# EAGLE design pot_controller_v1.0 (EAGLE 9.6.2)
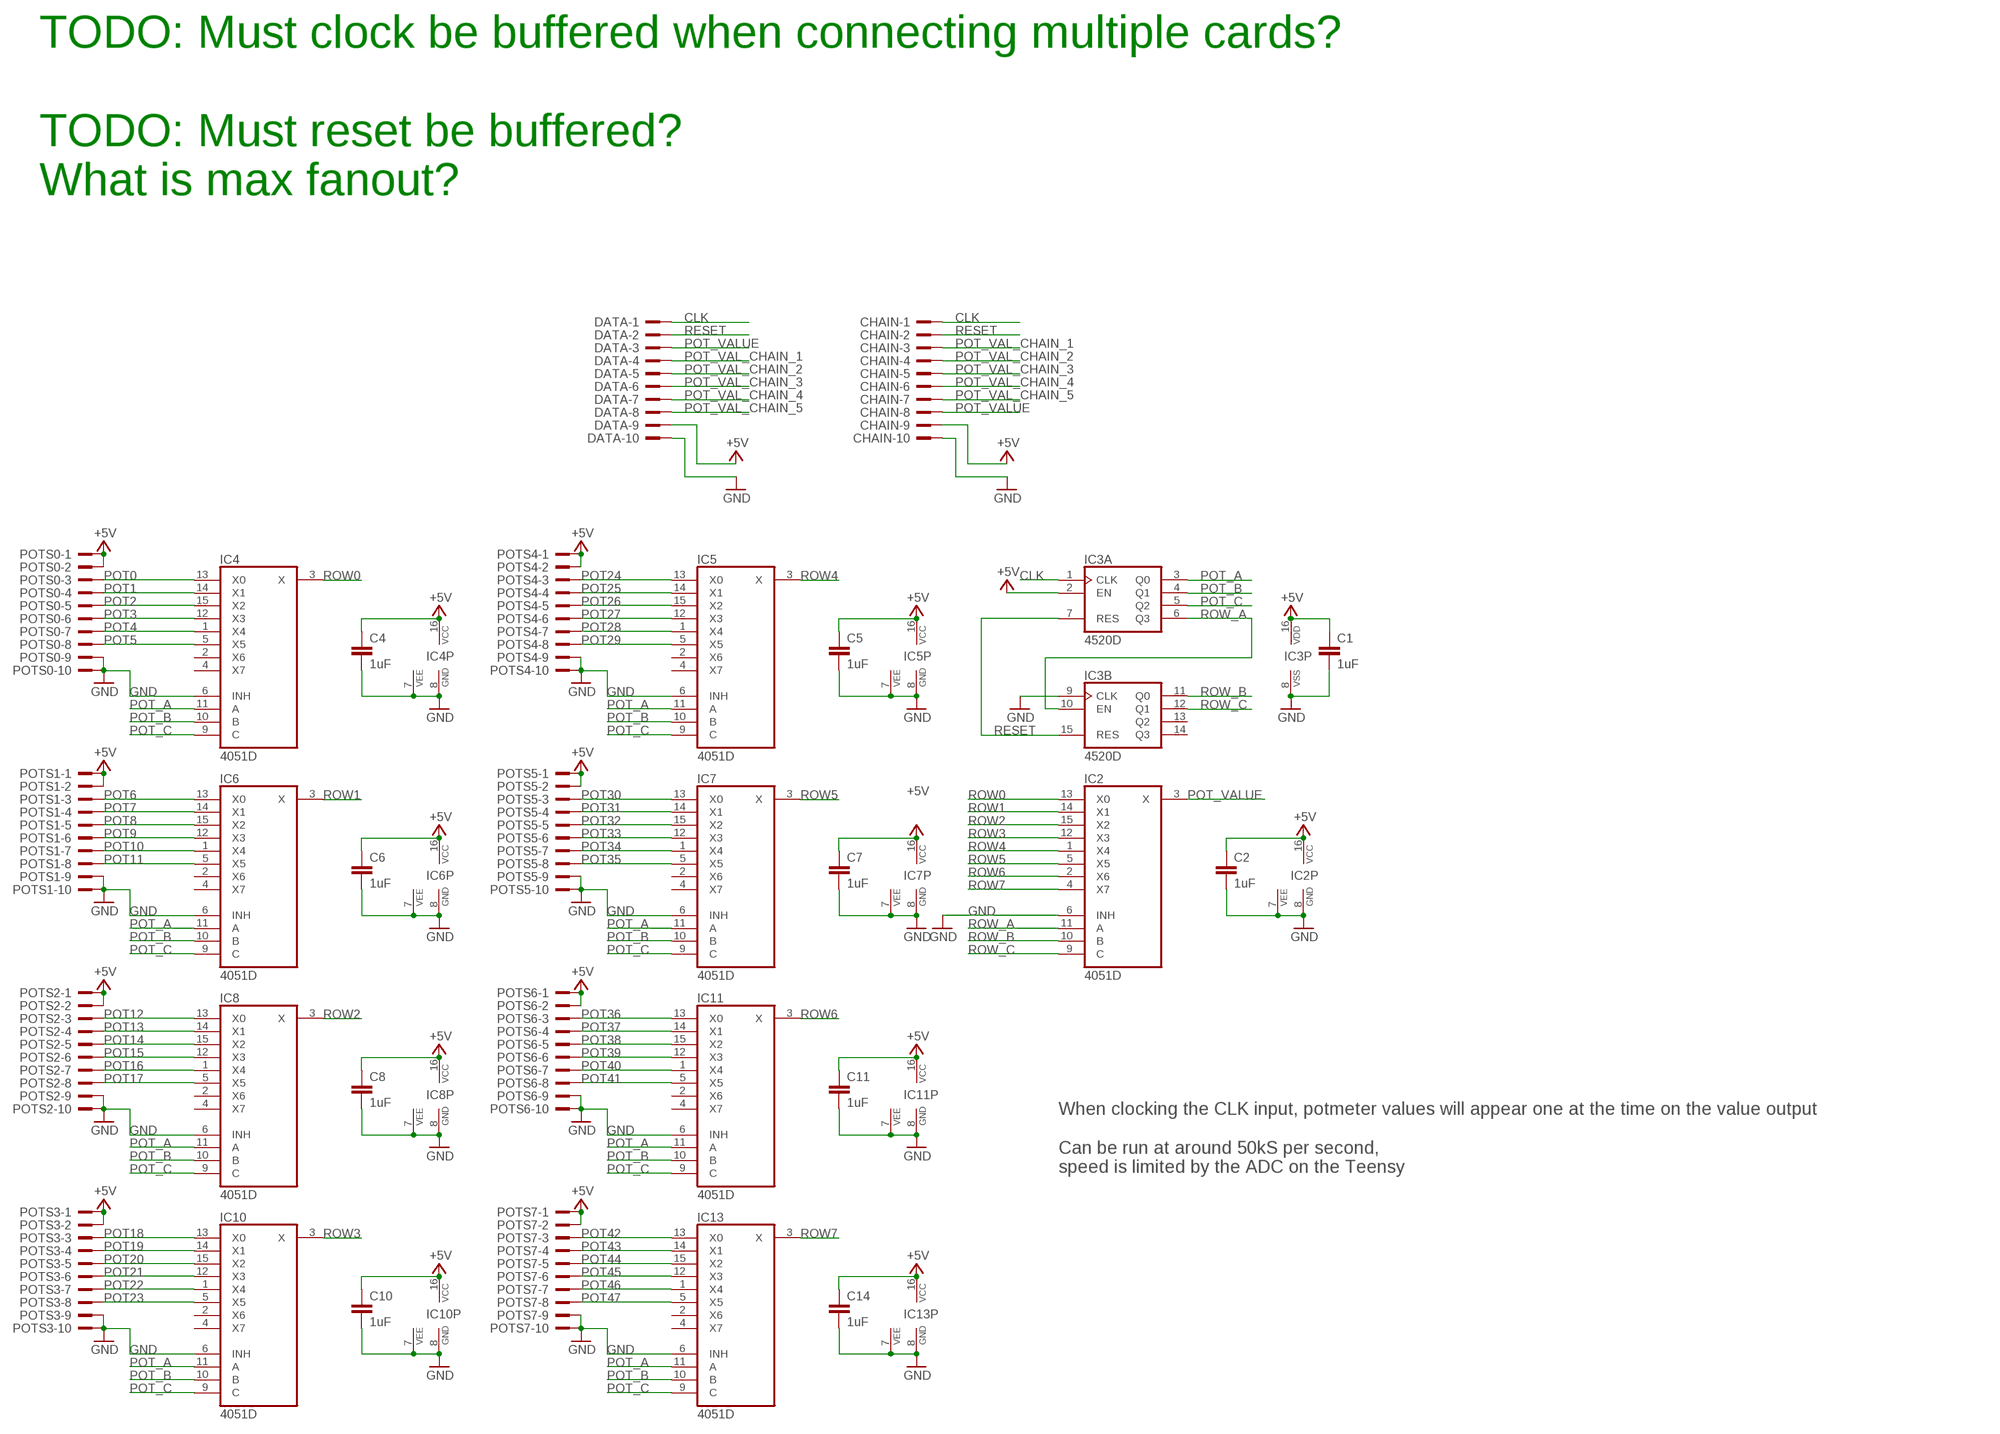
[diagram p0: schematic, sheet 1]

## Parts
C1  1uF  C-EU-J0603  [C0603-J]
C2  1uF  C-EU-J0603  [C0603-J]
C4  1uF  C-EU-J0603  [C0603-J]
C5  1uF  C-EU-J0603  [C0603-J]
C6  1uF  C-EU-J0603  [C0603-J]
C7  1uF  C-EU-J0603  [C0603-J]
C8  1uF  C-EU-J0603  [C0603-J]
C10  1uF  C-EU-J0603  [C0603-J]
C11  1uF  C-EU-J0603  [C0603-J]
C14  1uF  C-EU-J0603  [C0603-J]
CHAIN  CONN-IDC-10PS  [CONN-IDC10P-S]
DATA  CONN-IDC-10PS  [CONN-IDC10P-S]
IC2  4051D  [SO16]
IC3  4520D  [SO16]
IC4  4051D  [SO16]
IC5  4051D  [SO16]
IC6  4051D  [SO16]
IC7  4051D  [SO16]
IC8  4051D  [SO16]
IC10  4051D  [SO16]
IC11  4051D  [SO16]
IC13  4051D  [SO16]
POTS0  CONN-IDC-10PS  [CONN-IDC10P-S]
POTS1  CONN-IDC-10PS  [CONN-IDC10P-S]
POTS2  CONN-IDC-10PS  [CONN-IDC10P-S]
POTS3  CONN-IDC-10PS  [CONN-IDC10P-S]
POTS4  CONN-IDC-10PS  [CONN-IDC10P-S]
POTS5  CONN-IDC-10PS  [CONN-IDC10P-S]
POTS6  CONN-IDC-10PS  [CONN-IDC10P-S]
POTS7  CONN-IDC-10PS  [CONN-IDC10P-S]

## Nets
+5V: C1.1 C2.1 C4.1 C5.1 C6.1 C7.1 C8.1 C10.1 C11.1 C14.1 CHAIN.9 DATA.9 IC2.16(VCC) IC3.2(A:EN) IC3.16(P:VDD) IC4.16(VCC) IC5.16(VCC) IC6.16(VCC) IC7.16(VCC) IC8.16(VCC) IC10.16(VCC) IC11.16(VCC) IC13.16(VCC) POTS0.1 POTS0.2 POTS1.1 POTS1.2 POTS2.1 POTS2.2 POTS3.1 POTS3.2 POTS4.1 POTS4.2 POTS5.1 POTS5.2 POTS6.1 POTS6.2 POTS7.1 POTS7.2
CLK: CHAIN.1 DATA.1 IC3.1(A:CLK)
GND: C1.2 C2.2 C4.2 C5.2 C6.2 C7.2 C8.2 C10.2 C11.2 C14.2 CHAIN.10 DATA.10 IC2.6(INH) IC2.7(VEE) IC2.8(GND) IC3.8(P:VSS) IC3.9(B:CLK) IC4.6(INH) IC4.7(VEE) IC4.8(GND) IC5.6(INH) IC5.7(VEE) IC5.8(GND) IC6.6(INH) IC6.7(VEE) IC6.8(GND) IC7.6(INH) IC7.7(VEE) IC7.8(GND) IC8.6(INH) IC8.7(VEE) IC8.8(GND) IC10.6(INH) IC10.7(VEE) IC10.8(GND) IC11.6(INH) IC11.7(VEE) IC11.8(GND) IC13.6(INH) IC13.7(VEE) IC13.8(GND) POTS0.9 POTS0.10 POTS1.9 POTS1.10 POTS2.9 POTS2.10 POTS3.9 POTS3.10 POTS4.9 POTS4.10 POTS5.9 POTS5.10 POTS6.9 POTS6.10 POTS7.9 POTS7.10
POT0: IC4.13(X0) POTS0.3
POT1: IC4.14(X1) POTS0.4
POT2: IC4.15(X2) POTS0.5
POT3: IC4.12(X3) POTS0.6
POT4: IC4.1(X4) POTS0.7
POT5: IC4.5(X5) POTS0.8
POT6: IC6.13(X0) POTS1.3
POT7: IC6.14(X1) POTS1.4
POT8: IC6.15(X2) POTS1.5
POT9: IC6.12(X3) POTS1.6
POT10: IC6.1(X4) POTS1.7
POT11: IC6.5(X5) POTS1.8
POT12: IC8.13(X0) POTS2.3
POT13: IC8.14(X1) POTS2.4
POT14: IC8.15(X2) POTS2.5
POT15: IC8.12(X3) POTS2.6
POT16: IC8.1(X4) POTS2.7
POT17: IC8.5(X5) POTS2.8
POT18: IC10.13(X0) POTS3.3
POT19: IC10.14(X1) POTS3.4
POT20: IC10.15(X2) POTS3.5
POT21: IC10.12(X3) POTS3.6
POT22: IC10.1(X4) POTS3.7
POT23: IC10.5(X5) POTS3.8
POT24: IC5.13(X0) POTS4.3
POT25: IC5.14(X1) POTS4.4
POT26: IC5.15(X2) POTS4.5
POT27: IC5.12(X3) POTS4.6
POT28: IC5.1(X4) POTS4.7
POT29: IC5.5(X5) POTS4.8
POT30: IC7.13(X0) POTS5.3
POT31: IC7.14(X1) POTS5.4
POT32: IC7.15(X2) POTS5.5
POT33: IC7.12(X3) POTS5.6
POT34: IC7.1(X4) POTS5.7
POT35: IC7.5(X5) POTS5.8
POT36: IC11.13(X0) POTS6.3
POT37: IC11.14(X1) POTS6.4
POT38: IC11.15(X2) POTS6.5
POT39: IC11.12(X3) POTS6.6
POT40: IC11.1(X4) POTS6.7
POT41: IC11.5(X5) POTS6.8
POT42: IC13.13(X0) POTS7.3
POT43: IC13.14(X1) POTS7.4
POT44: IC13.15(X2) POTS7.5
POT45: IC13.12(X3) POTS7.6
POT46: IC13.1(X4) POTS7.7
POT47: IC13.5(X5) POTS7.8
POT_A: IC3.3(A:Q0) IC4.11(A) IC5.11(A) IC6.11(A) IC7.11(A) IC8.11(A) IC10.11(A) IC11.11(A) IC13.11(A)
POT_B: IC3.4(A:Q1) IC4.10(B) IC5.10(B) IC6.10(B) IC7.10(B) IC8.10(B) IC10.10(B) IC11.10(B) IC13.10(B)
POT_C: IC3.5(A:Q2) IC4.9(C) IC5.9(C) IC6.9(C) IC7.9(C) IC8.9(C) IC10.9(C) IC11.9(C) IC13.9(C)
POT_VAL_CHAIN_1: CHAIN.3 DATA.4
POT_VAL_CHAIN_2: CHAIN.4 DATA.5
POT_VAL_CHAIN_3: CHAIN.5 DATA.6
POT_VAL_CHAIN_4: CHAIN.6 DATA.7
POT_VAL_CHAIN_5: CHAIN.7 DATA.8
POT_VALUE: CHAIN.8 DATA.3 IC2.3(X)
RESET: CHAIN.2 DATA.2 IC3.7(A:RES) IC3.15(B:RES)
ROW0: IC2.13(X0) IC4.3(X)
ROW1: IC2.14(X1) IC6.3(X)
ROW2: IC2.15(X2) IC8.3(X)
ROW3: IC2.12(X3) IC10.3(X)
ROW4: IC2.1(X4) IC5.3(X)
ROW5: IC2.5(X5) IC7.3(X)
ROW6: IC2.2(X6) IC11.3(X)
ROW7: IC2.4(X7) IC13.3(X)
ROW_A: IC2.11(A) IC3.6(A:Q3) IC3.10(B:EN)
ROW_B: IC2.10(B) IC3.11(B:Q0)
ROW_C: IC2.9(C) IC3.12(B:Q1)
Unconnected: IC3.13(B:Q2) IC3.14(B:Q3) IC4.2(X6) IC4.4(X7) IC5.2(X6) IC5.4(X7) IC6.2(X6) IC6.4(X7) IC7.2(X6) IC7.4(X7) IC8.2(X6) IC8.4(X7) IC10.2(X6) IC10.4(X7) IC11.2(X6) IC11.4(X7) IC13.2(X6) IC13.4(X7)

## Notes on the sheet
- TODO: Must clock be buffered when connecting multiple cards?
  
  TODO: Must reset be buffered?
  What is max fanout?
- When clocking the CLK input, potmeter values will appear one at the time on the value output
  
  Can be run at around 50kS per second,
  speed is limited by the ADC on the Teensy

## Library data of the parts
C1 C2 C4-C8 C10 C11 C14 = joakim:C-EU-J: CAPACITOR, European symbol
CHAIN DATA POTS0 POTS1-POTS7 = joakim:CONN-IDC-10P: 10P IDC Header
IC2 IC4-IC8 IC10 IC11 IC13 = 40xx:4051: 8-channel ANALOG MULTIPLEXER
IC3 = 45xx:4520: Dual binary up COUNTER

## Board
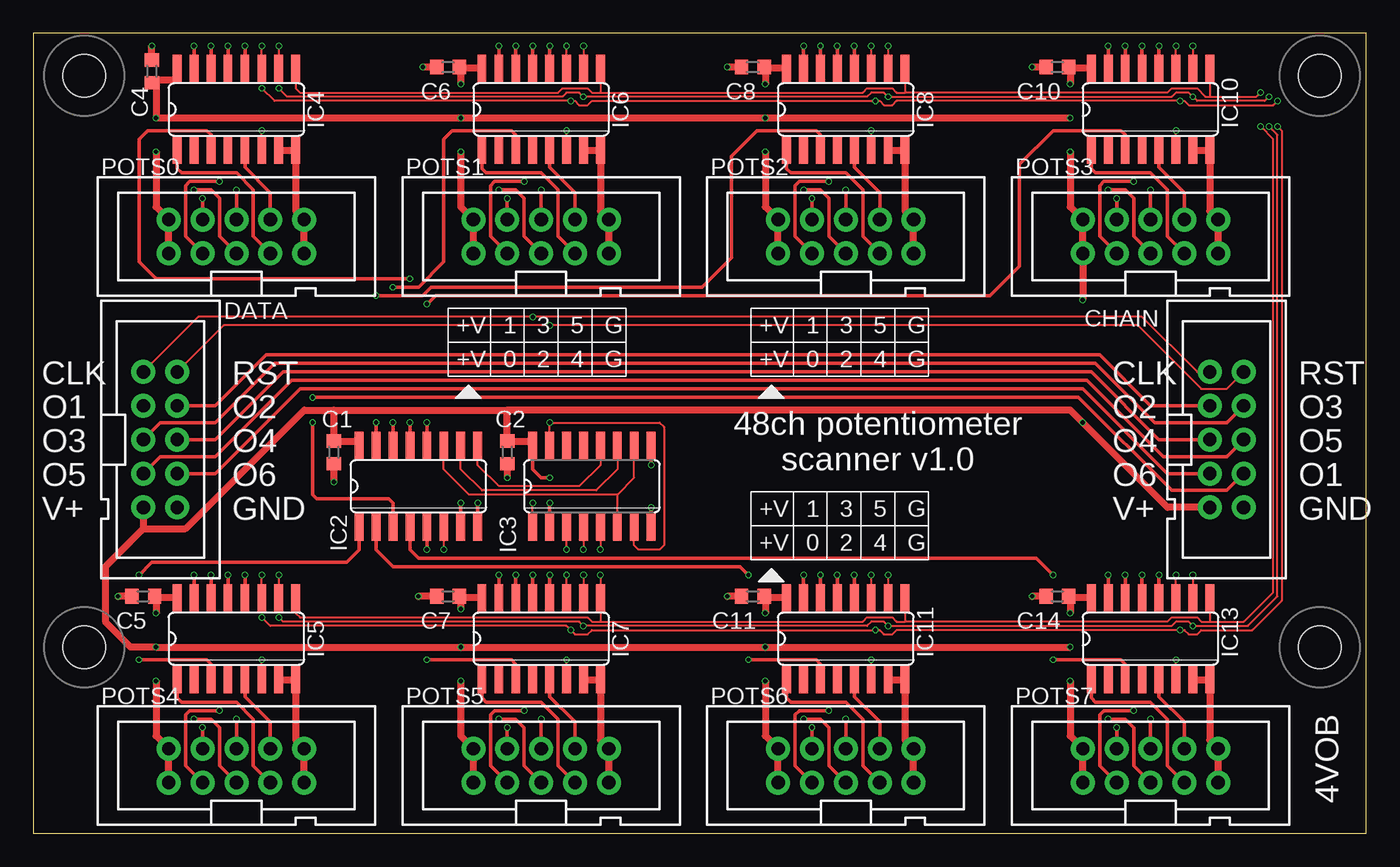
[diagram p1: board, top side]
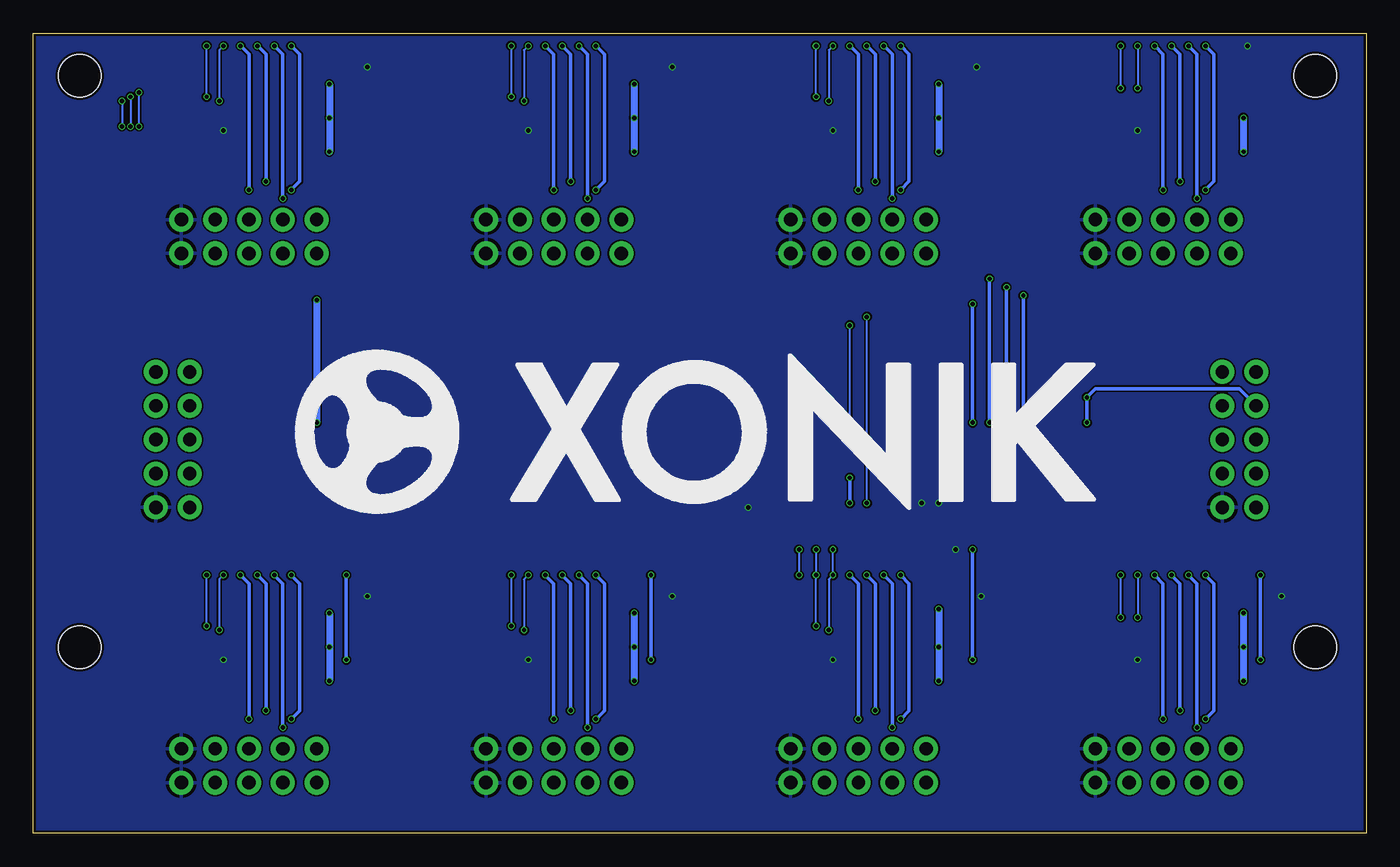
[diagram p2: board, bottom side, seen from below]

Size 100 x 60 mm. Coordinates in mm from the lower left corner, seen from the top.
Outline: 0,0 100,0 100,60 0,60 0,0
Copper layers (1*16): Top 0.035mm / dielectric 1.6mm / Bottom 0.035mm
Design rules "jlcpcb-2layers": minimum track width 5mil, minimum drill 0.3mm, track to track 5mil, track to pad 5mil, pad to pad 5mil, via to via 5mil, smd to smd 5mil, copper to edge 0.2mm, drill to drill 6mil, minimum pad ring 10mil, minimum via ring 3mil, stop-mask expansion 4mil, vias tented up to drill 0mil, thermal gap 10mil
Holes 3.2 mm at 3.81,13.97 96.52,13.97 96.52,56.83 3.81,56.83

### Footprints (pad centres in the part's own frame; a part is rotated, then mirrored left to right if it is on the bottom)
C0603-J = smd 1 x 1.1: 1 -0.85,0; 2 0.85,0
CONN-IDC10P-S = drill 1 pad 1.422: 1 -5.08,-1.27; 2 -5.08,1.27; 3 -2.54,-1.27; 4 -2.54,1.27; 5 0,-1.27; 6 0,1.27; 7 2.54,-1.27; 8 2.54,1.27; 9 5.08,-1.27; 10 5.08,1.27
SO16 = smd 0.66 x 2.032: 1 -4.445,-3.073; 2 -3.175,-3.073; 3 -1.905,-3.073; 4 -0.635,-3.073; 5 0.635,-3.073; 6 1.905,-3.073; 7 3.175,-3.073; 8 4.445,-3.073; 9 4.445,3.073; 10 3.175,3.073; 11 1.905,3.073; 12 0.635,3.073; 13 -0.635,3.073; 14 -1.905,3.073; 15 -3.175,3.073; 16 -4.445,3.073

### Placement (x,y rotation side)
C1  22.54,28.57 270 top
C2  35.56,28.57 270 top
C4  8.89,57.15 90 top
C5  8.26,17.78 180 top
C6  31.11,57.47 180 top
C7  31.11,17.78 180 top
C8  53.98,57.47 180 top
C10  76.83,57.47 180 top
C11  53.98,17.78 180 top
C14  76.83,17.78 180 top
CHAIN  89.53,29.53 270 top
DATA  9.53,29.53 270 top
IC2  28.89,26.04 0 top
IC3  41.91,26.04 0 top
IC4  15.24,54.29 0 top
IC5  15.24,14.61 0 top
IC6  38.1,54.29 0 top
IC7  38.1,14.61 0 top
IC8  60.96,54.29 0 top
IC10  83.82,54.29 0 top
IC11  60.96,14.61 0 top
IC13  83.82,14.61 0 top
POTS0  15.24,44.77 0 top
POTS1  38.1,44.77 0 top
POTS2  60.96,44.77 0 top
POTS3  83.82,44.77 0 top
POTS4  15.24,5.08 0 top
POTS5  38.1,5.08 0 top
POTS6  60.96,5.08 0 top
POTS7  83.82,5.08 0 top
U$1  [XONIK_LOGO_60]  80.33,24 0 bottom

### Tracks (layer width: path | path; a pad name or v marks a point on that pad's centre or on a via)
+5V  (via drill 0.33)
  Top 0.254: IC3.16 37.47,27.3 38.1,26.67 v38.73,26.67 | v38.73,24.77 IC3.2
  Top 0.508: POTS0.1 POTS0.2 9.21,46.99 v9.21,51.12 | IC6.16 32.07,57.37 C6.1 | POTS1.1 POTS1.2 32.07,46.99 v32.07,51.12 | C6.1 32.07,57.37 v32.07,56.2 | C6.1 32.07,57.57 | IC8.16 54.93,57.37 C8.1 | POTS2.1 POTS2.2 54.93,46.99 v54.93,51.12 | C8.1 54.93,57.37 v54.93,56.2 | C8.1 54.93,57.57 | IC10.16 77.79,57.37 C10.1 | C10.1 77.79,57.37 v77.79,56.2 | v77.79,51.12 77.79,46.99 POTS3.2 POTS3.1 v78.74,40.01 | C10.1 77.79,57.57 | IC5.16 9.21,17.68 C5.1 | POTS4.1 POTS4.2 9.21,7.3 v9.21,11.43 | C5.1 9.21,17.68 v9.21,16.51 | C5.1 9.21,17.88 | IC7.16 32.07,17.68 C7.1 | POTS5.1 POTS5.2 32.07,7.3 v32.07,11.43 | C7.1 32.07,17.68 v32.07,16.83 | C7.1 32.07,17.88 | IC11.16 54.93,17.68 C11.1 | POTS6.1 POTS6.2 54.93,7.3 v54.93,11.43 | C11.1 54.93,17.68 v54.93,16.51 | C11.1 54.93,17.88 | v77.79,13.97 v54.93,13.97 v32.07,13.97 v9.21,13.97 7.3,13.97 5.4,15.88 5.4,20 8.26,22.86 | IC13.16 77.79,17.68 C14.1 | POTS7.1 POTS7.2 77.79,7.3 v77.79,11.43 | C14.1 77.79,17.68 v77.79,16.51 | C14.1 77.79,17.88 | v77.79,53.66 v54.93,53.66 v32.07,53.66 v9.21,53.66 9.21,56.41 C4.1 9.11,56.52 10.79,56.52 IC4.16 | CHAIN.9 85.09,24.45 v78.74,30.8 77.79,31.75 35.56,31.75 | DATA.9 8.26,22.86 | 8.26,22.86 11.43,22.86 20.32,31.75 22.54,31.75 | 22.54,31.75 35.56,31.75 | 22.54,31.75 C1.1 24.13,29.43 IC2.16 | 35.56,31.75 C2.1 37.15,29.43 IC3.16
  Bottom 0.254: v38.73,26.67 v38.73,24.77
  Bottom 0.508: v9.21,53.66 v9.21,51.12 | v32.07,56.2 v32.07,53.66 v32.07,51.12 | v54.93,56.2 v54.93,53.66 v54.93,51.12 | v77.79,56.2 v77.79,53.66 v77.79,51.12 | v9.21,16.51 v9.21,13.97 v9.21,11.43 | v32.07,16.83 v32.07,13.97 v32.07,11.43 | v54.93,16.51 v54.93,13.97 v54.93,11.43 | v77.79,16.51 v77.79,13.97 v77.79,11.43 | v78.74,40.01 v78.74,30.8
CLK  (via drill 0.33)
  Top 0.152: DATA.1 12.38,38.73 v37.47,38.73 83.19,38.73 87.31,34.61 CHAIN.1 | IC3.1 v37.47,24.77
  Bottom 0.152: v37.47,24.77 v37.47,38.73
GND  (via drill 0.33)
  Top 0.152: IC2.6 v30.8,21.27 | IC4.6 v17.14,52.7 | IC5.6 v17.14,13.02 | IC7.6 v40.01,13.02 | IC11.6 v62.87,13.02 | IC13.6 v85.72,13.02 | IC10.6 v85.72,52.7 | IC8.6 v62.87,52.7 | IC6.6 v40.01,52.7
  Top 0.254: IC3.8 v46.35,24.45 | IC3.9 v46.35,27.62 | IC2.8 v33.34,24.77 | IC2.7 v32.07,24.77
  Top 0.508: IC4.7 IC4.8 19.68,46.67 POTS0.10 POTS0.9 | C4.2 v8.89,59.05 | IC6.7 IC6.8 42.55,46.67 POTS1.10 POTS1.9 | C6.2 v29.21,57.47 | IC8.7 IC8.8 65.41,46.67 POTS2.10 POTS2.9 | C8.2 v52.07,57.47 | IC10.7 IC10.8 88.27,46.67 POTS3.10 POTS3.9 | C10.2 v74.93,57.47 | IC5.7 IC5.8 19.68,6.99 POTS4.10 POTS4.9 | C5.2 v6.35,17.78 | IC7.7 IC7.8 42.55,6.99 POTS5.10 POTS5.9 | C7.2 v28.89,17.78 | IC11.7 IC11.8 65.41,6.99 POTS6.10 POTS6.9 | C11.2 v52.07,17.78 | IC13.7 IC13.8 88.27,6.99 POTS7.10 POTS7.9 | C14.2 v74.93,17.78 | C2.2 v35.56,26.67 | C1.2 v22.54,26.35
  pour Bottom: -2.54,66.04 102.87,66.04 102.87,-2.54 -2.54,-2.54
POT0  (via drill 0.33)
  Top 0.254: v14.61,59.05 IC4.13 | POTS0.3 11.43,44.77 11.43,48.58 11.75,48.9 v13.97,48.9
  Bottom 0.254: v13.97,48.9 13.97,58.42 v14.61,59.05
POT1  (via drill 0.33)
  Top 0.254: IC4.14 v13.34,59.05 | POTS0.4 v12.7,47.62
  Bottom 0.254: v12.7,47.62 12.7,58.42 v13.34,59.05
POT2  (via drill 0.33)
  Top 0.254: IC4.15 v12.06,59.05 | POTS0.5 13.97,44.77 13.97,47.62 13.34,48.26 v12.06,48.26
  Bottom 0.254: v12.06,59.05 11.43,58.42 11.43,48.9 v12.06,48.26
POT3  (via drill 0.33)
  Top 0.254: v15.88,59.05 IC4.12 | v15.24,48.26 POTS0.6
  Bottom 0.254: v15.24,48.26 15.24,58.42 v15.88,59.05
POT4
  Top 0.254: IC4.1 10.79,49.85 11.11,49.53 15.24,49.53 16.51,48.26 16.51,44.77 POTS0.7
POT5
  Top 0.254: POTS0.8 17.78,48.04 15.88,49.95 IC4.5
POT6  (via drill 0.33)
  Top 0.254: v37.47,59.05 IC6.13 | POTS1.3 34.29,44.77 34.29,48.58 34.61,48.9 v36.83,48.9
  Bottom 0.254: v36.83,48.9 36.83,58.42 v37.47,59.05
POT7  (via drill 0.33)
  Top 0.254: IC6.14 v36.2,59.05 | POTS1.4 v35.56,47.62
  Bottom 0.254: v35.56,47.62 35.56,58.42 v36.2,59.05
POT8  (via drill 0.33)
  Top 0.254: IC6.15 v34.92,59.05 | POTS1.5 36.83,44.77 36.83,47.62 36.2,48.26 v34.92,48.26
  Bottom 0.254: v34.92,59.05 34.29,58.42 34.29,48.9 v34.92,48.26
POT9  (via drill 0.33)
  Top 0.254: v38.73,59.05 IC6.12 | v38.1,48.26 POTS1.6
  Bottom 0.254: v38.1,48.26 38.1,58.42 v38.73,59.05
POT10
  Top 0.254: IC6.1 33.66,49.85 33.97,49.53 38.1,49.53 39.37,48.26 39.37,44.77 POTS1.7
POT11
  Top 0.254: POTS1.8 40.64,48.04 38.73,49.95 IC6.5
POT12  (via drill 0.33)
  Top 0.254: v60.33,59.05 IC8.13 | POTS2.3 57.15,44.77 57.15,48.58 57.47,48.9 v59.69,48.9
  Bottom 0.254: v59.69,48.9 59.69,58.42 v60.33,59.05
POT13  (via drill 0.33)
  Top 0.254: IC8.14 v59.05,59.05 | POTS2.4 v58.42,47.62
  Bottom 0.254: v58.42,47.62 58.42,58.42 v59.05,59.05
POT14  (via drill 0.33)
  Top 0.254: IC8.15 v57.78,59.05 | POTS2.5 59.69,44.77 59.69,47.62 59.05,48.26 v57.78,48.26
  Bottom 0.254: v57.78,59.05 57.15,58.42 57.15,48.9 v57.78,48.26
POT15  (via drill 0.33)
  Top 0.254: v61.59,59.05 IC8.12 | v60.96,48.26 POTS2.6
  Bottom 0.254: v60.96,48.26 60.96,58.42 v61.59,59.05
POT16
  Top 0.254: IC8.1 56.52,49.85 56.83,49.53 60.96,49.53 62.23,48.26 62.23,44.77 POTS2.7
POT17
  Top 0.254: POTS2.8 63.5,48.04 61.59,49.95 IC8.5
POT18  (via drill 0.33)
  Top 0.254: v83.19,59.05 IC10.13 | POTS3.3 80.01,44.77 80.01,48.58 80.33,48.9 v82.55,48.9
  Bottom 0.254: v82.55,48.9 82.55,58.42 v83.19,59.05
POT19  (via drill 0.33)
  Top 0.254: IC10.14 v81.92,59.05 | POTS3.4 v81.28,47.62
  Bottom 0.254: v81.28,47.62 81.28,58.42 v81.92,59.05
POT20  (via drill 0.33)
  Top 0.254: IC10.15 v80.64,59.05 | POTS3.5 82.55,44.77 82.55,47.62 81.92,48.26 v80.64,48.26
  Bottom 0.254: v80.64,59.05 80.01,58.42 80.01,48.9 v80.64,48.26
POT21  (via drill 0.33)
  Top 0.254: v84.45,59.05 IC10.12 | v83.82,48.26 POTS3.6
  Bottom 0.254: v83.82,48.26 83.82,58.42 v84.45,59.05
POT22
  Top 0.254: IC10.1 79.38,49.85 79.69,49.53 83.82,49.53 85.09,48.26 85.09,44.77 POTS3.7
POT23
  Top 0.254: POTS3.8 86.36,48.04 84.45,49.95 IC10.5
POT24  (via drill 0.33)
  Top 0.254: v14.61,19.37 IC5.13 | POTS4.3 11.43,5.08 11.43,8.89 11.75,9.21 v13.97,9.21
  Bottom 0.254: v13.97,9.21 13.97,18.73 v14.61,19.37
POT25  (via drill 0.33)
  Top 0.254: IC5.14 v13.34,19.37 | POTS4.4 v12.7,7.94
  Bottom 0.254: v12.7,7.94 12.7,18.73 v13.34,19.37
POT26  (via drill 0.33)
  Top 0.254: IC5.15 v12.06,19.37 | POTS4.5 13.97,5.08 13.97,7.94 13.34,8.57 v12.06,8.57
  Bottom 0.254: v12.06,19.37 11.43,18.73 11.43,9.21 v12.06,8.57
POT27  (via drill 0.33)
  Top 0.254: v15.88,19.37 IC5.12 | v15.24,8.57 POTS4.6
  Bottom 0.254: v15.24,8.57 15.24,18.73 v15.88,19.37
POT28
  Top 0.254: IC5.1 10.79,10.16 11.11,9.84 15.24,9.84 16.51,8.57 16.51,5.08 POTS4.7
POT29
  Top 0.254: POTS4.8 17.78,8.36 15.88,10.26 IC5.5
POT30  (via drill 0.33)
  Top 0.254: v37.47,19.37 IC7.13 | POTS5.3 34.29,5.08 34.29,8.89 34.61,9.21 v36.83,9.21
  Bottom 0.254: v36.83,9.21 36.83,18.73 v37.47,19.37
POT31  (via drill 0.33)
  Top 0.254: IC7.14 v36.2,19.37 | POTS5.4 v35.56,7.94
  Bottom 0.254: v35.56,7.94 35.56,18.73 v36.2,19.37
POT32  (via drill 0.33)
  Top 0.254: IC7.15 v34.92,19.37 | POTS5.5 36.83,5.08 36.83,7.94 36.2,8.57 v34.92,8.57
  Bottom 0.254: v34.92,19.37 34.29,18.73 34.29,9.21 v34.92,8.57
POT33  (via drill 0.33)
  Top 0.254: v38.73,19.37 IC7.12 | v38.1,8.57 POTS5.6
  Bottom 0.254: v38.1,8.57 38.1,18.73 v38.73,19.37
POT34
  Top 0.254: IC7.1 33.66,10.16 33.97,9.84 38.1,9.84 39.37,8.57 39.37,5.08 POTS5.7
POT35
  Top 0.254: POTS5.8 40.64,8.36 38.73,10.26 IC7.5
POT36  (via drill 0.33)
  Top 0.254: v60.33,19.37 IC11.13 | POTS6.3 57.15,5.08 57.15,8.89 57.47,9.21 v59.69,9.21
  Bottom 0.254: v59.69,9.21 59.69,18.73 v60.33,19.37
POT37  (via drill 0.33)
  Top 0.254: IC11.14 v59.05,19.37 | POTS6.4 v58.42,7.94
  Bottom 0.254: v58.42,7.94 58.42,18.73 v59.05,19.37
POT38  (via drill 0.33)
  Top 0.254: IC11.15 v57.78,19.37 | POTS6.5 59.69,5.08 59.69,7.94 59.05,8.57 v57.78,8.57
  Bottom 0.254: v57.78,19.37 57.15,18.73 57.15,9.21 v57.78,8.57
POT39  (via drill 0.33)
  Top 0.254: v61.59,19.37 IC11.12 | v60.96,8.57 POTS6.6
  Bottom 0.254: v60.96,8.57 60.96,18.73 v61.59,19.37
POT40
  Top 0.254: IC11.1 56.52,10.16 56.83,9.84 60.96,9.84 62.23,8.57 62.23,5.08 POTS6.7
POT41
  Top 0.254: POTS6.8 63.5,8.36 61.59,10.26 IC11.5
POT42  (via drill 0.33)
  Top 0.254: v83.19,19.37 IC13.13 | POTS7.3 80.01,5.08 80.01,8.89 80.33,9.21 v82.55,9.21
  Bottom 0.254: v82.55,9.21 82.55,18.73 v83.19,19.37
POT43  (via drill 0.33)
  Top 0.254: IC13.14 v81.92,19.37 | POTS7.4 v81.28,7.94
  Bottom 0.254: v81.28,7.94 81.28,18.73 v81.92,19.37
POT44  (via drill 0.33)
  Top 0.254: IC13.15 v80.64,19.37 | POTS7.5 82.55,5.08 82.55,7.94 81.92,8.57 v80.64,8.57
  Bottom 0.254: v80.64,19.37 80.01,18.73 80.01,9.21 v80.64,8.57
POT45  (via drill 0.33)
  Top 0.254: v84.45,19.37 IC13.12 | v83.82,8.57 POTS7.6
  Bottom 0.254: v83.82,8.57 83.82,18.73 v84.45,19.37
POT46
  Top 0.254: IC13.1 79.38,10.16 79.69,9.84 83.82,9.84 85.09,8.57 85.09,5.08 POTS7.7
POT47
  Top 0.254: POTS7.8 86.36,8.36 84.45,10.26 IC13.5
POT_A  (via drill 0.33)
  Top 0.152: v17.14,55.88 18.1,54.93 v40.32,54.93 40.64,54.93 40.96,54.61 41.59,54.61 41.91,54.93 v63.18,54.93 63.5,54.93 63.82,54.61 64.45,54.61 64.77,54.93 v86.04,54.93 86.36,54.93 86.68,54.61 93.03,54.61 v93.34,54.93 | IC4.11 v17.14,59.05 | IC6.11 v40.01,59.05 | IC8.11 v62.87,59.05 | IC10.11 v85.72,59.05 | v17.14,16.19 17.78,15.56 40.01,15.56 v40.32,15.24 40.64,14.92 41.59,14.92 41.91,15.24 v63.18,15.24 63.5,15.24 63.82,14.92 64.45,14.92 64.77,15.24 v86.04,15.24 86.36,15.24 86.68,14.92 87.31,14.92 87.63,15.24 91.44,15.24 93.66,17.46 93.66,52.7 v93.34,53.02 | IC5.11 v17.14,19.37 | IC7.11 v40.01,19.37 | IC11.11 v62.87,19.37 | IC13.11 v85.72,19.37 | v40.01,21.27 IC3.3
  Bottom 0.152: v17.14,59.05 v17.14,55.88 | v40.01,59.05 40.32,58.74 v40.32,54.93 | v62.87,59.05 63.18,58.74 v63.18,54.93 | v85.72,59.05 86.04,58.74 v86.04,54.93 | v17.14,19.37 v17.14,16.19 | v40.32,15.24 40.32,19.05 v40.01,19.37 v40.01,21.27 | v62.87,19.37 63.18,19.05 v63.18,15.24 | v85.72,19.37 86.04,19.05 v86.04,15.24 | v93.34,54.93 v93.34,53.02
POT_B  (via drill 0.33, 0.35)
  Top 0.152: v18.41,59.05 IC4.10 | v41.27,59.05 IC6.10 | v64.14,59.05 IC8.10 | v87,59.05 IC10.10 | v18.41,19.37 IC5.10 | v41.27,19.37 IC7.10 | v64.14,19.37 IC11.10 | v87,19.37 IC13.10 | v18.41,55.88 19.05,55.24 39.69,55.24 40.01,55.56 40.96,55.56 v41.27,55.24 62.55,55.24 62.87,55.56 63.82,55.56 v64.14,55.24 85.41,55.24 85.72,55.56 86.68,55.56 v87,55.24 87.31,54.93 92.39,54.93 v92.71,55.24 | v18.41,16.19 18.73,15.88 40.96,15.88 v41.27,15.56 62.55,15.56 62.87,15.88 63.82,15.88 v64.14,15.56 85.41,15.56 85.72,15.88 86.68,15.88 v87,15.56 91.12,15.56 93.34,17.78 93.34,52.39 v92.71,53.02 | IC3.4 v41.27,21.27
  Bottom 0.152: v18.41,55.88 v18.41,59.05 | v41.27,55.24 v41.27,59.05 | v64.14,55.24 v64.14,59.05 | v87,55.24 v87,59.05 | v18.41,16.19 v18.41,19.37 | v41.27,15.56 v41.27,19.37 v41.27,21.27 | v64.14,15.56 v64.14,19.37 | v87,15.56 v87,19.37 | v92.71,55.24 v92.71,53.02
POT_C  (via drill 0.33)
  Top 0.152: IC4.9 19.68,55.88 20,55.56 39.37,55.56 39.69,55.88 41.59,55.88 41.91,55.56 42.55,55.56 | IC6.9 42.55,55.56 | 65.41,55.56 64.77,55.56 64.45,55.88 62.55,55.88 62.23,55.56 42.55,55.56 | IC8.9 65.41,55.56 | 88.27,55.24 87.95,55.24 87.31,55.88 85.41,55.88 85.09,55.56 65.41,55.56 | IC10.9 88.27,55.24 | IC5.9 19.68,16.51 20,16.19 41.59,16.19 41.91,15.88 42.55,15.88 | 42.55,15.88 IC7.9 v42.55,19.37 | 65.41,15.88 64.77,15.88 64.45,16.19 62.55,16.19 62.23,15.88 42.55,15.88 | IC11.9 65.41,15.88 | 88.27,15.88 87.63,15.88 87.31,16.19 85.41,16.19 85.09,15.88 65.41,15.88 | 88.27,15.88 90.81,15.88 93.03,18.1 93.03,52.07 v92.08,53.02 | IC13.9 88.27,15.88 | v92.08,55.56 91.76,55.24 88.27,55.24 | IC3.5 v42.55,21.27
  Bottom 0.152: v92.08,55.56 v92.08,53.02 | v42.55,21.27 v42.55,19.37
POT_VAL_CHAIN_1
  Top 0.254: CHAIN.3 83.82,32.07 80.01,35.88 17.46,35.88 13.65,32.07 DATA.4
POT_VAL_CHAIN_2
  Top 0.254: DATA.5 9.53,30.8 13.65,30.8 18.1,35.24 79.69,35.24 84.14,30.8 89.53,30.8 CHAIN.4
POT_VAL_CHAIN_3
  Top 0.254: DATA.6 13.65,29.53 18.73,34.61 79.38,34.61 84.45,29.53 CHAIN.5
POT_VAL_CHAIN_4
  Top 0.254: DATA.7 9.53,28.26 13.65,28.26 19.37,33.97 79.06,33.97 84.77,28.26 89.53,28.26 CHAIN.6
POT_VAL_CHAIN_5
  Top 0.254: DATA.8 13.65,26.99 20,33.34 78.74,33.34 85.09,26.99 CHAIN.7
POT_VALUE  (via drill 0.33)
  Top 0.254: CHAIN.8 89.53,25.72 85.41,25.72 78.42,32.7 v20.95,32.7 | IC2.3 26.99,24.77 26.67,25.08 21.27,25.08 20.95,25.4 v20.95,30.8
  Bottom 0.254: v20.95,30.8 v20.95,32.7 20.32,33.34 9.53,33.34 DATA.3
RESET  (via drill 0.33)
  Top 0.152: DATA.2 14.29,38.1 v38.73,38.1 82.87,38.1 87.63,33.34 89.53,33.34 CHAIN.2 | IC3.15 v38.73,30.8 46.99,30.8 47.31,30.48 47.31,21.59 46.99,21.27 45.4,21.27 45.09,21.59 IC3.7
  Bottom 0.152: v38.73,30.8 v38.73,38.1
ROW0  (via drill 0.33)
  Top 0.254: IC4.3 13.34,52.39 13.02,52.7 8.57,52.7 7.94,52.07 7.94,42.86 9.21,41.59 v28.26,41.59 | IC2.13 v28.26,30.8
  Bottom 0.254: v28.26,30.8 v28.26,41.59
ROW1  (via drill 0.33)
  Top 0.254: IC6.3 36.2,52.39 35.88,52.7 31.43,52.7 30.8,52.07 30.8,42.86 28.89,40.96 v26.99,40.96 | v26.99,30.8 IC2.14
  Bottom 0.254: v26.99,40.96 v26.99,30.8
ROW2  (via drill 0.33)
  Top 0.254: IC8.3 59.05,52.39 58.74,52.7 54.29,52.7 52.39,50.8 52.39,43.18 50.16,40.96 29.84,40.96 29.21,40.32 v25.72,40.32 | v25.72,30.8 IC2.15
  Bottom 0.254: v25.72,40.32 v25.72,30.8
ROW3  (via drill 0.33)
  Top 0.254: IC10.3 81.92,52.39 81.6,52.7 76.52,52.7 73.98,50.16 73.98,42.55 71.75,40.32 30.16,40.32 v29.53,39.69 | v29.53,30.8 IC2.12
  Bottom 0.254: v29.53,39.69 v29.53,30.8
ROW4  (via drill 0.33)
  Top 0.254: IC5.3 13.34,12.7 13.02,13.02 v7.94,13.02 | v7.94,19.37 8.89,20.32 23.5,20.32 24.45,21.27 IC2.1
  Bottom 0.254: v7.94,13.02 v7.94,19.37
ROW5  (via drill 0.33)
  Top 0.254: IC7.3 36.2,12.7 35.88,13.02 v29.53,13.02 | IC2.5 v29.53,21.27
  Bottom 0.254: v29.53,21.27 v29.53,13.02
ROW6  (via drill 0.33)
  Top 0.254: IC11.3 59.05,12.7 58.74,13.02 v53.66,13.02 | v53.66,19.37 53.02,20 26.99,20 25.72,21.27 IC2.2
  Bottom 0.254: v53.66,13.02 v53.66,19.37
ROW7  (via drill 0.33)
  Top 0.254: IC13.3 81.92,12.7 81.6,13.02 v76.52,13.02 | v76.52,19.37 75.25,20.64 28.89,20.64 28.26,21.27 IC2.4
  Bottom 0.254: v76.52,13.02 v76.52,19.37
ROW_A
  Top 0.152: IC3.6 43.81,25.4 | IC2.11 30.8,27.3 32.7,25.4 43.81,25.4 | 43.81,25.4 45.09,26.67 IC3.10
ROW_B
  Top 0.152: IC3.11 43.81,27.3 42.23,25.72 33.66,25.72 32.07,27.3 IC2.10
ROW_C
  Top 0.152: IC3.12 42.55,27.62 40.96,26.04 34.92,26.04 33.34,27.62 IC2.9

### Text on the board
tNames: +V | 1 | 3 | 5 | G | +V | 1 | 3 | 5 | G | +V | 0 | 2 | 4 | G | +V | 0 | 2 | 4 | G | CLK | RST | CLK | RST | O1 | O2 | O2 | O3 | O3 | O4 | O4 | O5 | 48ch potentiometer / scanner v1.0 | O5 | O6 | O6 | O1 | +V | 1 | 3 | 5 | G | V+ | GND | V+ | GND | +V | 0 | 2 | 4 | G | 4VOB